# Altium schematic sheet sch_sensor.SchDoc
size A4
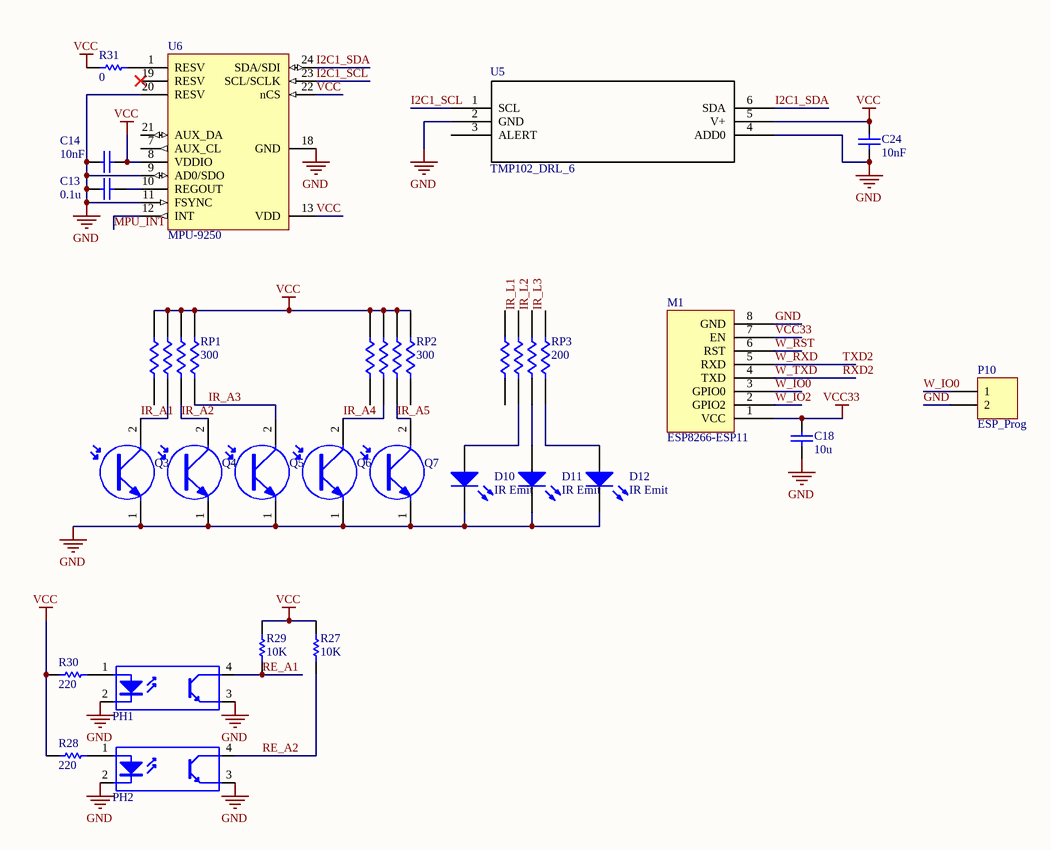
[diagram p0: sch_sensor.SchDoc]

## Parts
C13  value 0.1u  [C-1608[0603]]  (hidden comment: Cap Semi)
C14  value 10nF  [C-1608[0603]]  (hidden comment: Cap Semi)
C18  value 10u  [C-1608[0603]]  (hidden comment: Cap Semi)
C24  value 10nF  [C-1608[0603]]  (hidden comment: Cap Semi)
D10  IR Emit  [LED-0]
D11  IR Emit  [LED-0]
D12  IR Emit  [LED-0]
M1  ESP8266-ESP11  [ESP8266-ESP11]
P10  ESP_Prog  [EDGE_1]
PH1  Optoisolator1  [RPR359F]  (value not drawn)
PH2  Optoisolator1  [RPR359F]  (value not drawn)
Q3  IR_Photo_NPN  [PHOTO_NPN]  (value not drawn)
Q4  IR_Photo_NPN  [PHOTO_NPN]  (value not drawn)
Q5  IR_Photo_NPN  [PHOTO_NPN]  (value not drawn)
Q6  IR_Photo_NPN  [PHOTO_NPN]  (value not drawn)
Q7  IR_Photo_NPN  [PHOTO_NPN]  (value not drawn)
R27  value 10K  [R-1608[0603]]  (hidden comment: Res Semi)
R28  value 220  [R-1608[0603]]  (hidden comment: Res Semi)
R29  value 10K  [R-1608[0603]]  (hidden comment: Res Semi)
R30  value 220  [R-1608[0603]]  (hidden comment: Res Semi)
R31  value 0  [R-1608[0603]]  (hidden comment: Res Semi)
RP1  300  [R0603x4]
RP2  300  [R0603x4]
RP3  200  [R0603x4]
U5  TMP102_DRL_6  [DRL6]
U6  MPU-9250  [MPU9250]

## Nets
GND: C13.2 C14.2 C18.1 C24.2 D10.2(K) D11.2(K) D12.2(K) M1.8(GND) P10.2 PH1.2(K) PH1.3(E) PH2.2(K) PH2.3(E) Q3.1(E) Q4.1(E) Q5.1(E) Q6.1(E) Q7.1(E) U5.2(GND) U5.4(ADD0) U6.9(AD0/SDO) U6.11(FSYNC) U6.18(GND) U6.20(RESV)
VCC: C14.1 C24.1 R27.2 R28.2 R29.2 R30.2 R31.1 RP1.1 RP1.2 RP1.3 RP1.4 RP2.1 RP2.2 RP2.3 RP2.4 U5.5(V+) U6.8(VDDIO) U6.13(VDD) U6.22(nCS)
VCC33: C18.2 M1.1(VCC) M1.7(EN)
I2C1_SCL: U5.1(SCL) U6.23(SCL/SCLK)
I2C1_SDA: U5.6(SDA) U6.24(SDA/SDI)
IR_A1: Q3.2(C) RP1.6
IR_A2: Q4.2(C) RP1.7
IR_A3: Q5.2(C) RP1.8
IR_A4: Q6.2(C) RP2.6
IR_A5: Q7.2(C) RP2.7
IR_L1: RP3.3
IR_L2: RP3.2
IR_L3: RP3.1
MPU_INT: U6.12(INT)
RE_A1: PH1.4(C) R29.1
RE_A2: PH2.4(C) R27.1
RXD2: M1.4(TXD)  [also labelled W_TXD]
TXD2: M1.5(RXD)  [also labelled W_RXD]
W_IO0: M1.3(GPIO0) P10.1
W_IO2: M1.2(GPIO2)
W_RST: M1.6(RST)
NetC13_1: C13.1 U6.10(REGOUT)
NetD10_1: D10.1(A) RP3.6
NetD11_1: D11.1(A) RP3.7
NetD12_1: D12.1(A) RP3.8
NetPH1_1: PH1.1(A) R30.1
NetPH2_1: PH2.1(A) R28.1
NetR31_2: R31.2 U6.1(RESV)

Not connected (* = marked no-connect by the designer): RP1 5; RP2 5 8; RP3 4 5; U5 3(ALERT); U6 7(AUX_CL) 19(RESV)* 21(AUX_DA)

## Library data of the parts
C13 C14 C18 C24 = Cap Semi: Capacitor (Semiconductor SIM Model); Published: 8-Jun-2000; LatestRevisionDate: 17-Jul-2002; LatestRevisionNote: Re-released for DXP Platform.; PackageReference: C1206; Publisher: Altium Limited
D10-D12 = LED0: Typical INFRARED GaAs LED; Published: 8-Jun-2000; LatestRevisionDate: 08-Jul-2005; LatestRevisionNote: Mech Layer 1 removed.; PackageReference: LED-0; Publisher: Altium Limited; PackageDescription: LED; 2 Leads
P10 = Header 2: Header, 2-Pin; LatestRevisionDate: 17-Jul-2002; LatestRevisionNote: Re-released for DXP Platform.; Publisher: Altium Limited
PH1 PH2 = Optoisolator1: 4-Pin Phototransistor Optocoupler; Published: 24-Mar-1999; LatestRevisionDate: 04-Mar-2005; LatestRevisionNote: Sch pins 3 & 4 Swapped.; DatasheetVersion: Nov-2003; PackageReference: DIP-4; Publisher: Altium Limited
Q3-Q7 = IR_Photo_NPN: NPN Phototransistor; Published: 24-Mar-1999; LatestRevisionDate: 17-Jul-2002; LatestRevisionNote: Re-released for DXP Platform.; PackageReference: TO-220_A; Publisher: Altium Limited; Code_JEDEC: TO-220-AC
R27-R31 = Res Semi: Semiconductor Resistor; Published: 8-Jun-2000; LatestRevisionDate: 17-Jul-2002; LatestRevisionNote: Re-released for DXP Platform.; PackageReference: AXIAL-0.5; Publisher: Altium Limited
  R27-R30: PackageDescription: Axial Device, Thru-Hole; 2 Leads; 0.5 in Pin Spacing
RP1-RP3 = RPACK4
U5 = TMP102_DRL_6: Imported; GENERIC_PART_NUMBER: TMP102; Vendor: Texas Instruments; PACKAGE_DESIGNATOR: DRL; PIN_COUNT: 6; FAMILY_NAME: TEMPERATURE SENSOR; INDUSTRY_STD_PKG_TYPE: SOT; Manufacturer_Part_Number: tmp102_drl_6; Datasheet URL: http://www.ti.com/lit/gpn/TMP102; Manufacturer: Texas Instruments; RefDes: RefDes; Type: DEV; Value: Value
U6 = MPU-9250: Integrated 6-axis MotionTracking device
M1 = ESP8266-ESP11: Value: http://item.taobao.com/item.htm?id=41802488823